# Altium schematic sheet Peripherals.SchDoc
size A
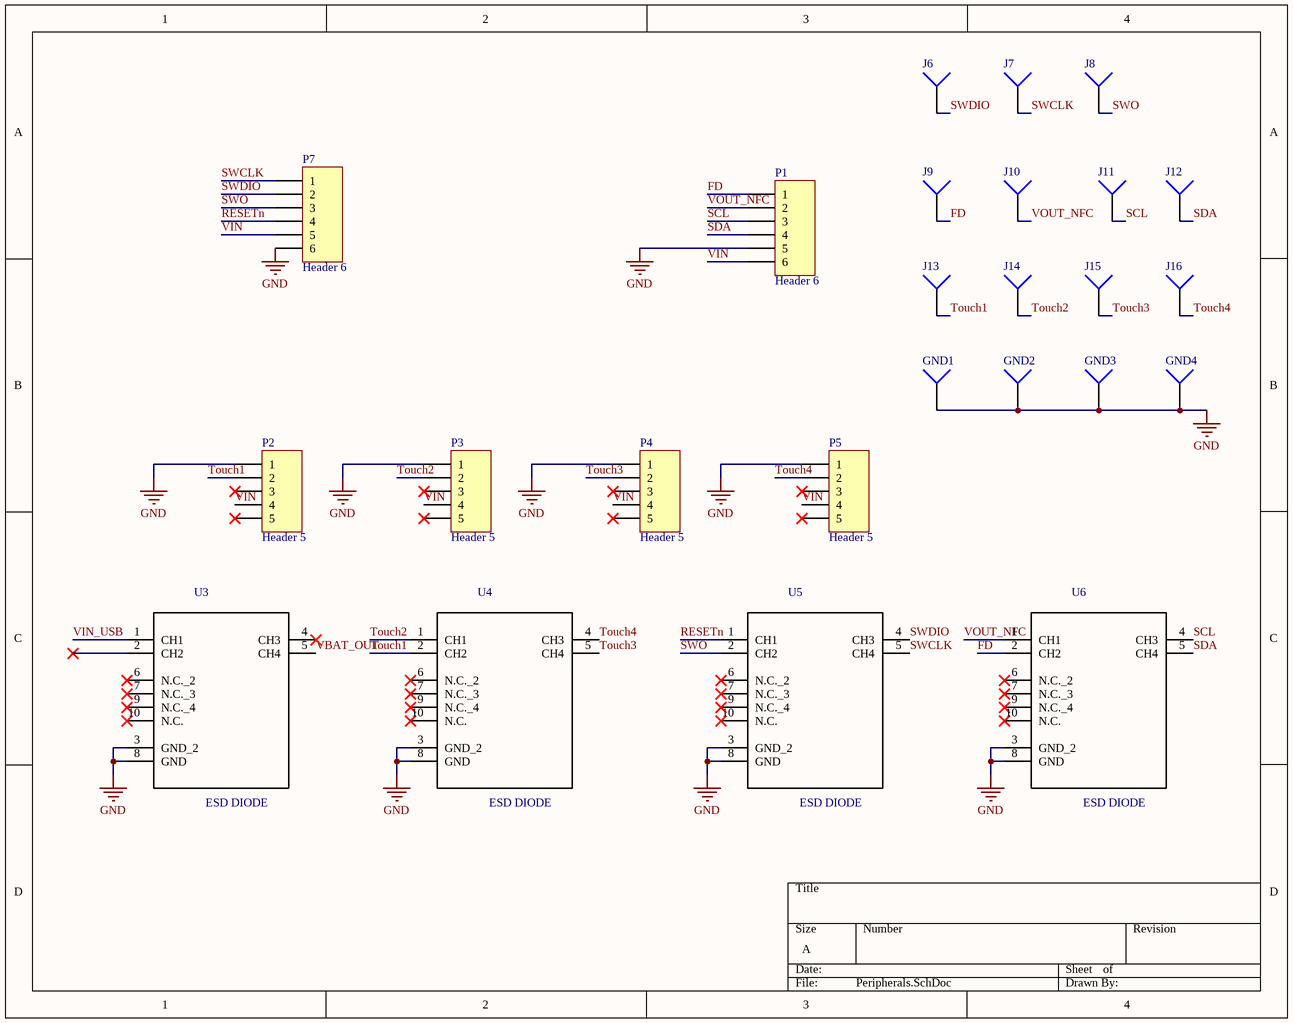
[diagram p0: Peripherals.SchDoc]

## Parts
GND1  Socket  [PIN1]  (value not drawn)
GND2  Socket  [PIN1]  (value not drawn)
GND3  Socket  [PIN1]  (value not drawn)
GND4  Socket  [PIN1]  (value not drawn)
J6  Socket  [PIN1]  (value not drawn)
J7  Socket  [PIN1]  (value not drawn)
J8  Socket  [PIN1]  (value not drawn)
J9  Socket  [PIN1]  (value not drawn)
J10  Socket  [PIN1]  (value not drawn)
J11  Socket  [PIN1]  (value not drawn)
J12  Socket  [PIN1]  (value not drawn)
J13  Socket  [PIN1]  (value not drawn)
J14  Socket  [PIN1]  (value not drawn)
J15  Socket  [PIN1]  (value not drawn)
J16  Socket  [PIN1]  (value not drawn)
P1  Header 6  [HDR1X6]
P2  Header 5  [HDR1X5]
P3  Header 5  [HDR1X5]
P4  Header 5  [HDR1X5]
P5  Header 5  [HDR1X5]
P7  Header 6  [HDR1X6]
U3  ESD DIODE  [SON50P100X255X50-10N]
U4  ESD DIODE  [SON50P100X255X50-10N]
U5  ESD DIODE  [SON50P100X255X50-10N]
U6  ESD DIODE  [SON50P100X255X50-10N]

## Nets
GND: GND1.1 GND2.1 GND3.1 GND4.1 P1.5 P2.1 P3.1 P4.1 P5.1 P7.6 U3.3(GND_2) U3.8(GND) U4.3(GND_2) U4.8(GND) U5.3(GND_2) U5.8(GND) U6.3(GND_2) U6.8(GND)
FD: J9.1 P1.1 U6.2(CH2)
RESETn: P7.4 U5.1(CH1)
SCL: J11.1 P1.3 U6.4(CH3)
SDA: J12.1 P1.4 U6.5(CH4)
SWCLK: J7.1 P7.1 U5.5(CH4)
SWDIO: J6.1 P7.2 U5.4(CH3)
SWO: J8.1 P7.3 U5.2(CH2)
Touch1: J13.1 P2.2 U4.2(CH2)
Touch2: J14.1 P3.2 U4.1(CH1)
Touch3: J15.1 P4.2 U4.5(CH4)
Touch4: J16.1 P5.2 U4.4(CH3)
VBAT_OUT: U3.5(CH4)
VIN: P1.6 P2.4 P3.4 P4.4 P5.4 P7.5
VIN_USB: U3.1(CH1)
VOUT_NFC: J10.1 P1.2 U6.1(CH1)

Not connected (* = marked no-connect by the designer): P2 3* 5*; P3 3* 5*; P4 3* 5*; P5 3* 5*; U3 2(CH2)* 4(CH3)* 6(N.C._2)* 7(N.C._3)* 9(N.C._4)* 10(N.C.)*; U4 6(N.C._2)* 7(N.C._3)* 9(N.C._4)* 10(N.C.)*; U5 6(N.C._2)* 7(N.C._3)* 9(N.C._4)* 10(N.C.)*; U6 6(N.C._2)* 7(N.C._3)* 9(N.C._4)* 10(N.C.)*

## Library data of the parts
P1 P7 = Header 6: Header, 6-Pin; LatestRevisionDate: 17-Jul-2002; LatestRevisionNote: Re-released for DXP Platform.; Publisher: Altium Limited
P2-P5 = Header 5: Header, 5-Pin; LatestRevisionDate: 17-Jul-2002; LatestRevisionNote: Re-released for DXP Platform.; Publisher: Altium Limited
U3-U6 = IP4292CZ10-TBR: TVS DIODE DFN2510A-10; Manufacturer: Nexperia USA Inc.; Manufacturer Part Number: PHDMI2FR4Z; Digi-Key Part Number: 1727-7821-1-ND; DatasheetLink: https://assets.nexperia.com/documents/data-sheet/PHDMI2FR4.pdf
GND1-GND4 J6-J16 = Socket: LatestRevisionDate: 17-Jul-2002; LatestRevisionNote: Re-released for DXP Platform.; Publisher: Altium Limited